# Altium schematic sheet 1_MCU.SchDoc
size A4; SheetNumber: 2; SheetTotal: 7
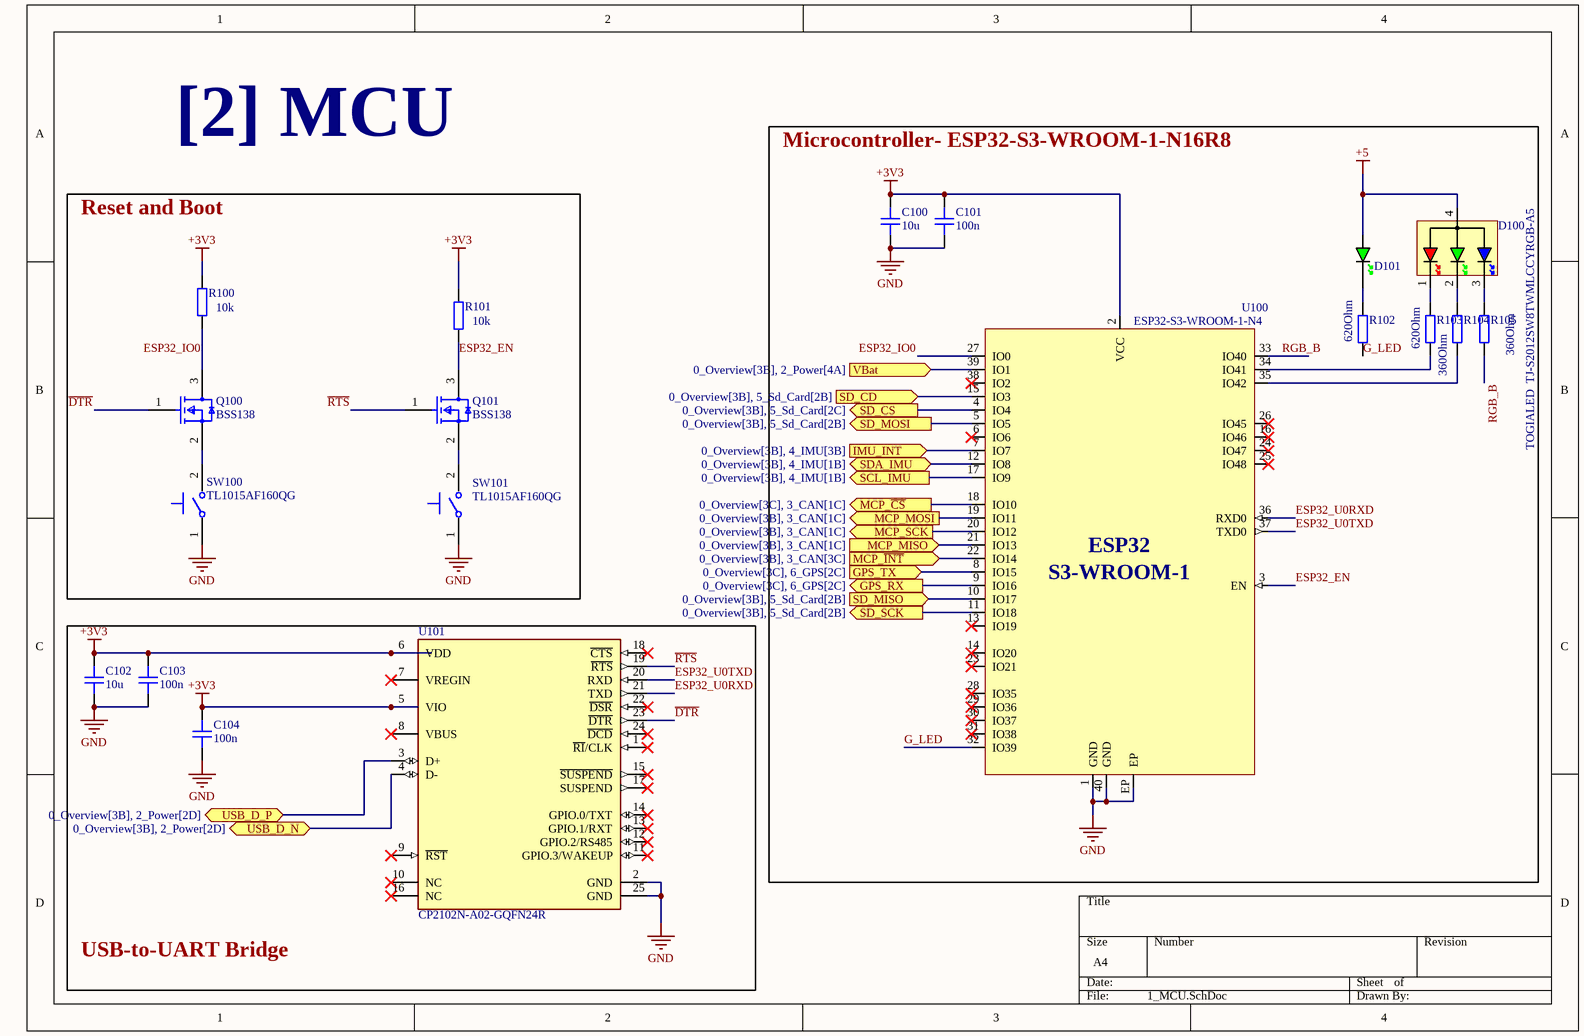
[diagram p0: 1_MCU.SchDoc]

## Parts
C100  10u  [CAP_0805]
C101  100n  [CAP_0603]
C102  10u  [CAP_0805]
C103  100n  [CAP_0603]
C104  100n  [CAP_0603]
D100  TOGIALED  TJ-S2012SW8TWMLCCYRGB-A5  [150080M153000]
D101  GREEN  [LED_0603_GREEN]  (value not drawn)
Q100  BSS138  [FP-318-08-IPC_B]
Q101  BSS138  [FP-318-08-IPC_B]
R100  10k  [RES_0603]
R101  10k  [RES_0603]
R102  620Ohm  [RES_0603]
R103  620Ohm  [RES_0603]
R104  360Ohm  [RES_0603]
R105  360Ohm  [RES_0603]
SW100  TL1015AF160QG  [FP-TL1015AF160QG-MFG]
SW101  TL1015AF160QG  [FP-TL1015AF160QG-MFG]
U100  ESP32-S3-WROOM-1-N4  [ESP32-S3-WROOM-1]
U101  CP2102N-A02-GQFN24R  [FP-CP2102N-A02-GQFN24R-MFG]

## Blocks framed on the sheet
Microcontroller- ESP32‑S3‑WROOM‑1‑N16R8: C100 C101 D100 D101 R102-R105 U100
Reset and Boot: Q100 Q101 R100 R101 SW100 SW101
USB‑to‑UART Bridge: C102-C104 U101

## Ports
GPS_RX (out, see 0_Overview[3C], 6_GPS[2C]), GPS_TX (in, see 0_Overview[3C], 6_GPS[2C]), IMU_INT (in, see 0_Overview[3B], 4_IMU[3B]), MCP_MISO (in, see 0_Overview[3B], 3_CAN[1C]), MCP_MOSI (out, see 0_Overview[3B], 3_CAN[1C]), MCP_SCK (out, see 0_Overview[3B], 3_CAN[1C]), MCP_~{CS} (out, see 0_Overview[3C], 3_CAN[1C]), MCP_~{INT} (in, see 0_Overview[3B], 3_CAN[3C]), SCL_IMU (out, see 0_Overview[3B], 4_IMU[1B]), SD_CD (in, see 0_Overview[3B], 5_Sd_Card[2B]), SD_CS (out, see 0_Overview[3B], 5_Sd_Card[2C]), SD_MISO (in, see 0_Overview[3B], 5_Sd_Card[2B]), SD_MOSI (out, see 0_Overview[3B], 5_Sd_Card[2B]), SD_SCK (out, see 0_Overview[3B], 5_Sd_Card[2B]), SDA_IMU (bidir, see 0_Overview[3B], 4_IMU[1B]), USB_D_N (bidir, see 0_Overview[3B], 2_Power[2D]), USB_D_P (bidir, see 0_Overview[3B], 2_Power[2D]), VBat (in, see 0_Overview[3B], 2_Power[4A])

## Nets
+3V3: C100.2 C101.1 C102.2 C103.1 C104.1 R100.2 R101.2 U100.2(VCC) U101.5(VIO) U101.6(VDD)
+5: D100.4(AC) D101.A
GND: C100.1 C101.2 C102.1 C103.2 C104.2 SW100.1 SW101.1 U100.1(GND) U100.40(GND) U100.EP U101.2(GND) U101.25(GND)
~{DTR}: Q100.1(G) U101.23(~{DTR})
ESP32_EN: Q101.3(D) R101.1 U100.3(EN)
ESP32_IO0: Q100.3(D) R100.1 U100.27(IO0)
ESP32_U0RXD: U100.36(RXD0) U101.21(TXD)
ESP32_U0TXD: U100.37(TXD0) U101.20(RXD)
G_LED: R102.1 U100.32(IO39)
GPS_RX: U100.9(IO16) ; port GPS_RX
GPS_TX: U100.8(IO15) ; port GPS_TX
IMU_INT: U100.7(IO7) ; port IMU_INT
MCP_~{CS}: U100.18(IO10) ; port MCP_~{CS}
MCP_~{INT}: U100.22(IO14) ; port MCP_~{INT}
MCP_MISO: U100.21(IO13) ; port MCP_MISO
MCP_MOSI: U100.19(IO11) ; port MCP_MOSI
MCP_SCK: U100.20(IO12) ; port MCP_SCK
~{RTS}: Q101.1(G) U101.19(~{RTS})
RGB_B: R105.1 U100.33(IO40)
SCL_IMU: U100.17(IO9) ; port SCL_IMU
SD_CD: U100.15(IO3) ; port SD_CD
SD_CS: U100.4(IO4) ; port SD_CS
SD_MISO: U100.10(IO17) ; port SD_MISO
SD_MOSI: U100.5(IO5) ; port SD_MOSI
SD_SCK: U100.11(IO18) ; port SD_SCK
SDA_IMU: U100.12(IO8) ; port SDA_IMU
USB_D_N: U101.4(D-) ; port USB_D_N
USB_D_P: U101.3(D+) ; port USB_D_P
VBat: U100.39(IO1) ; port VBat
NetD100_1: D100.1(CR) R103.2
NetD100_2: D100.2(CG) R104.2
NetD100_3: D100.3(CB) R105.2
NetD101_K: D101.K R102.2
NetQ100_2: Q100.2(S) SW100.2
NetQ101_2: Q101.2(S) SW101.2
NetR103_1: R103.1 U100.34(IO41)
NetR104_1: R104.1 U100.35(IO42)

Not connected (* = marked no-connect by the designer): U100 6(IO6)* 13(IO19)* 14(IO20)* 16(IO46)* 23(IO21)* 24(IO47)* 25(IO48)* 26(IO45)* 28(IO35)* 29(IO36)* 30(IO37)* 31(IO38)* 38(IO2)*; U101 1(~{RI}/CLK)* 7(VREGIN)* 8(VBUS)* 9(~{RST})* 10(NC)* 11(GPIO.3/WAKEUP)* 12(GPIO.2/RS485)* 13(GPIO.1/RXT)* 14(GPIO.0/TXT)* 15(~{SUSPEND})* 16(NC)* 17(SUSPEND)* 18(~{CTS})* 22(~{DSR})* 24(~{DCD})*

## Notes on the sheet
- [2] MCU
- (in symbol ESP32-S3-WROOM-1-N4) ESP32; S3-WROOM-1

## Library data of the parts
C100 C102 = CAP_0805: Capacitor SMD 0805; Manufacturer: *; Manufacturer Part Number: *; Distributor Link: *; LCSC: *; Rating: *; Dielectric: *
C101 C103 C104 = CAP_0603: Capacitor SMD 0603; Manufacturer: *; Manufacturer Part Number: *; Distributor Link: *; LCSC: *; Rating: *; Dielectric: *
D100 = 150080M153000: RGB LED Common Anode SMD Diffused 0805 Top View; Manufacturer: Wurth; Manufacturer Part Number: 150080M153000; Distributor Link: https://www.mouser.de/ProductDetail/Wurth-Elektronik/150080M153000?qs=5aG0NVq1C4wI5cZ2wabu5A%3D%3D
D101 = LED_0603_GREEN: LED 0603 GREEN SMD
Q100 Q101 = CMP-07173-000101-1: MOSFET N-CH 50V 220MA SOT-23; Turn-Off Delay Time: 20ns; Element Configuration: Single; Rds On Max: 3.5R; Gate to Source Voltage (Vgs): 20V; Threshold Voltage: 1.3V; Number of Elements: 1; Power Dissipation: 360mW; Rise Time: 9ns; Turn-On Delay Time: 2.5ns; Input Capacitance: 27pF; On-State Resistance: 6R; Lead Free: Lead Free; Length: 2.92mm; Width: 1.3mm; Drain to Source Breakdown Voltage: 50V; Min Operating Temperature: -55°C; REACH SVHC: No SVHC; Packaging: Tape and Reel; Radiation Hardening: No; Height: 0.93mm; Drain to Source Voltage (Vdss): 50V; Current Rating: 220mA; Voltage Rating (DC): 50V; Weight: 0.03g; Continuous Drain Current (ID): 220mA; Number of Pins: 3; Nominal Vgs: 1.3V; Max Power Dissipation: 360mW; Fall Time: 9ns; Drain to Source Resistance: 3.5R; Contact Plating: Tin; Case/Package: SOT-23; Package Quantity: 1; Dual Supply Voltage: 50V; Mount: Surface Mount; Termination: SMD/SMT; Max Operating Temperature: 150°C
R100-R105 = RES_0603: Resistor SMD 0603; Manufacturer: *; Manufacturer Part Number: *; Distributor Link: *; LCSC: *
SW100 SW101 = CMP-17879-000003-1: SWITCH TACTILE SPST-NO 0.05A 12V; Actuator Type: Standard; Actuator Length: 0.5mm; Contact Current Rating: 50mA; Mechanical Life: 200000Cycles; Switch Function: Off-Mom; Switch Travel: 0.2mm; Illumination Type: Non-Illuminated; Operating Force: 160gf; Actuator Material: Nylon; Electrical Life: 50000Cycles; Throw Configuration: SPST; Contact Resistance: 100mR; Orientation: Straight; Max Voltage Rating (DC): 12V; Max Operating Temperature: 70°C; Package Quantity: 1; Contact Material: Silver; Packaging: Tape and Reel; Mount: Surface Mount; Color: Beige; Termination: Gull Wing; Case/Package: SMD/SMT; Voltage Rating (DC): 12V; Contact Plating: Silver; REACH SVHC: No SVHC; Min Operating Temperature: -20°C; Current Rating: 50mA; Lead Free: Lead Free
U100 = ESP32-S3-WROOM-1-N4: 2.4 GHz Wi-Fi (802.11 b/g/n) and Bluetooth 5 (LE) Module ESP32-S3, 4MB Flash, on-board PCB antenna); Manufacturer: Espressif; Manufacturer Part Number: ESP32-S3-WROOM-1-N4; Distributor Link: https://www.mouser.de/ProductDetail/Espressif-Systems/ESP32-S3-WROOM-1-N4?qs=Li%252BoUPsLEnsO%2FkiJOUK0FQ%3D%3D
U101 = CMP-08107-000009-2: IC USB TO UART BRIDGE QFN24; Manufacturer Lifecycle Status: FULL PRODUCTION; NexarPartId: 99772192; Max Junction Temperature (Tj): 105°C; Min Supply Voltage: 1.71V; Max Supply Voltage: 3.6V; Number of Digital IO: 4; Interface: I2C, RS-485, UART, USB; Lifecycle Status: Production; Min Operating Temperature: -40°C; Height: 800µm; Ambient Temperature Range High: 85°C; Schedule B: 8542390000, 8542390000; Max Operating Temperature: 85°C